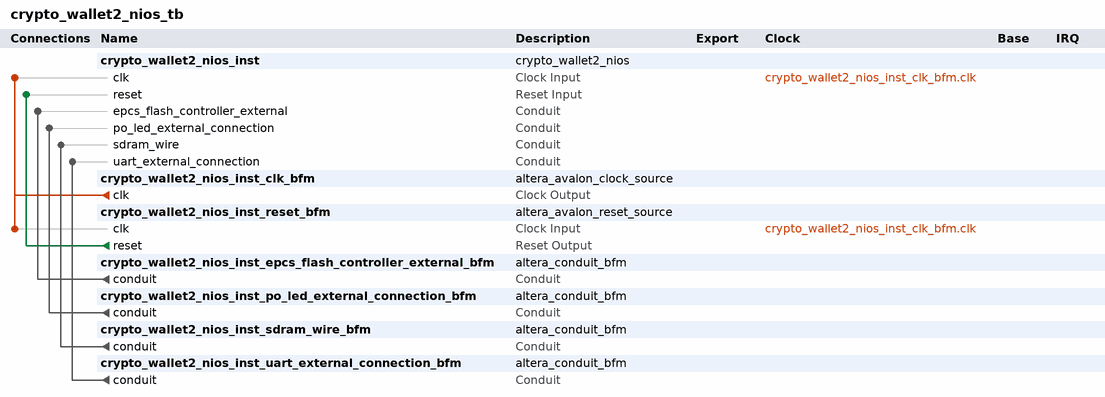
[diagram p0: system contents]
# Platform Designer (Qsys) system crypto_wallet2_nios_tb, Cyclone IV E EP4CE22F17C6
# Parameters at their usual value, and those the tool derives, are not listed.
package require -exact qsys 18.1
create_system crypto_wallet2_nios_tb
set_project_property DEVICE_FAMILY {Cyclone IV E}
set_project_property DEVICE EP4CE22F17C6

add_instance crypto_wallet2_nios_inst crypto_wallet2_nios 1.0

add_instance crypto_wallet2_nios_inst_clk_bfm altera_avalon_clock_source 18.1

add_instance crypto_wallet2_nios_inst_reset_bfm altera_avalon_reset_source 18.1
set_instance_parameter_value crypto_wallet2_nios_inst_reset_bfm ASSERT_HIGH_RESET 0
set_instance_parameter_value crypto_wallet2_nios_inst_reset_bfm INITIAL_RESET_CYCLES 50

add_instance crypto_wallet2_nios_inst_epcs_flash_controller_external_bfm altera_conduit_bfm 18.1
set_instance_parameter_value crypto_wallet2_nios_inst_epcs_flash_controller_external_bfm CLOCKED_SIGNAL false
set_instance_parameter_value crypto_wallet2_nios_inst_epcs_flash_controller_external_bfm ENABLE_RESET false
set_instance_parameter_value crypto_wallet2_nios_inst_epcs_flash_controller_external_bfm SIGNAL_DIRECTIONS output,input,input,input
set_instance_parameter_value crypto_wallet2_nios_inst_epcs_flash_controller_external_bfm SIGNAL_ROLES data0,dclk,sce,sdo
set_instance_parameter_value crypto_wallet2_nios_inst_epcs_flash_controller_external_bfm SIGNAL_WIDTHS 1,1,1,1

add_instance crypto_wallet2_nios_inst_po_led_external_connection_bfm altera_conduit_bfm 18.1
set_instance_parameter_value crypto_wallet2_nios_inst_po_led_external_connection_bfm CLOCKED_SIGNAL false
set_instance_parameter_value crypto_wallet2_nios_inst_po_led_external_connection_bfm ENABLE_RESET false
set_instance_parameter_value crypto_wallet2_nios_inst_po_led_external_connection_bfm SIGNAL_DIRECTIONS input
set_instance_parameter_value crypto_wallet2_nios_inst_po_led_external_connection_bfm SIGNAL_WIDTHS 8

add_instance crypto_wallet2_nios_inst_sdram_wire_bfm altera_conduit_bfm 18.1
set_instance_parameter_value crypto_wallet2_nios_inst_sdram_wire_bfm CLOCKED_SIGNAL false
set_instance_parameter_value crypto_wallet2_nios_inst_sdram_wire_bfm ENABLE_RESET false
set_instance_parameter_value crypto_wallet2_nios_inst_sdram_wire_bfm SIGNAL_DIRECTIONS input,input,input,input,input,bidir,input,input,input
set_instance_parameter_value crypto_wallet2_nios_inst_sdram_wire_bfm SIGNAL_ROLES addr,ba,cas_n,cke,cs_n,dq,dqm,ras_n,we_n
set_instance_parameter_value crypto_wallet2_nios_inst_sdram_wire_bfm SIGNAL_WIDTHS 13,2,1,1,1,16,2,1,1

add_instance crypto_wallet2_nios_inst_uart_external_connection_bfm altera_conduit_bfm 18.1
set_instance_parameter_value crypto_wallet2_nios_inst_uart_external_connection_bfm CLOCKED_SIGNAL false
set_instance_parameter_value crypto_wallet2_nios_inst_uart_external_connection_bfm ENABLE_RESET false
set_instance_parameter_value crypto_wallet2_nios_inst_uart_external_connection_bfm SIGNAL_DIRECTIONS output,input
set_instance_parameter_value crypto_wallet2_nios_inst_uart_external_connection_bfm SIGNAL_ROLES rxd,txd
set_instance_parameter_value crypto_wallet2_nios_inst_uart_external_connection_bfm SIGNAL_WIDTHS 1,1

# connections
add_connection crypto_wallet2_nios_inst_clk_bfm.clk crypto_wallet2_nios_inst.clk clock
add_connection crypto_wallet2_nios_inst_clk_bfm.clk crypto_wallet2_nios_inst_reset_bfm.clk clock
add_connection crypto_wallet2_nios_inst_reset_bfm.reset crypto_wallet2_nios_inst.reset reset
add_connection crypto_wallet2_nios_inst_epcs_flash_controller_external_bfm.conduit crypto_wallet2_nios_inst.epcs_flash_controller_external conduit
add_connection crypto_wallet2_nios_inst_po_led_external_connection_bfm.conduit crypto_wallet2_nios_inst.po_led_external_connection conduit
add_connection crypto_wallet2_nios_inst_sdram_wire_bfm.conduit crypto_wallet2_nios_inst.sdram_wire conduit
add_connection crypto_wallet2_nios_inst_uart_external_connection_bfm.conduit crypto_wallet2_nios_inst.uart_external_connection conduit

set_interconnect_requirement {$system} qsys_mm.clockCrossingAdapter HANDSHAKE
set_interconnect_requirement {$system} qsys_mm.enableEccProtection FALSE
set_interconnect_requirement {$system} qsys_mm.insertDefaultSlave FALSE
set_interconnect_requirement {$system} qsys_mm.maxAdditionalLatency 1

save_system crypto_wallet2_nios_tb.qsys
